# Altium project joint_board_boosterpack.PrjPCB
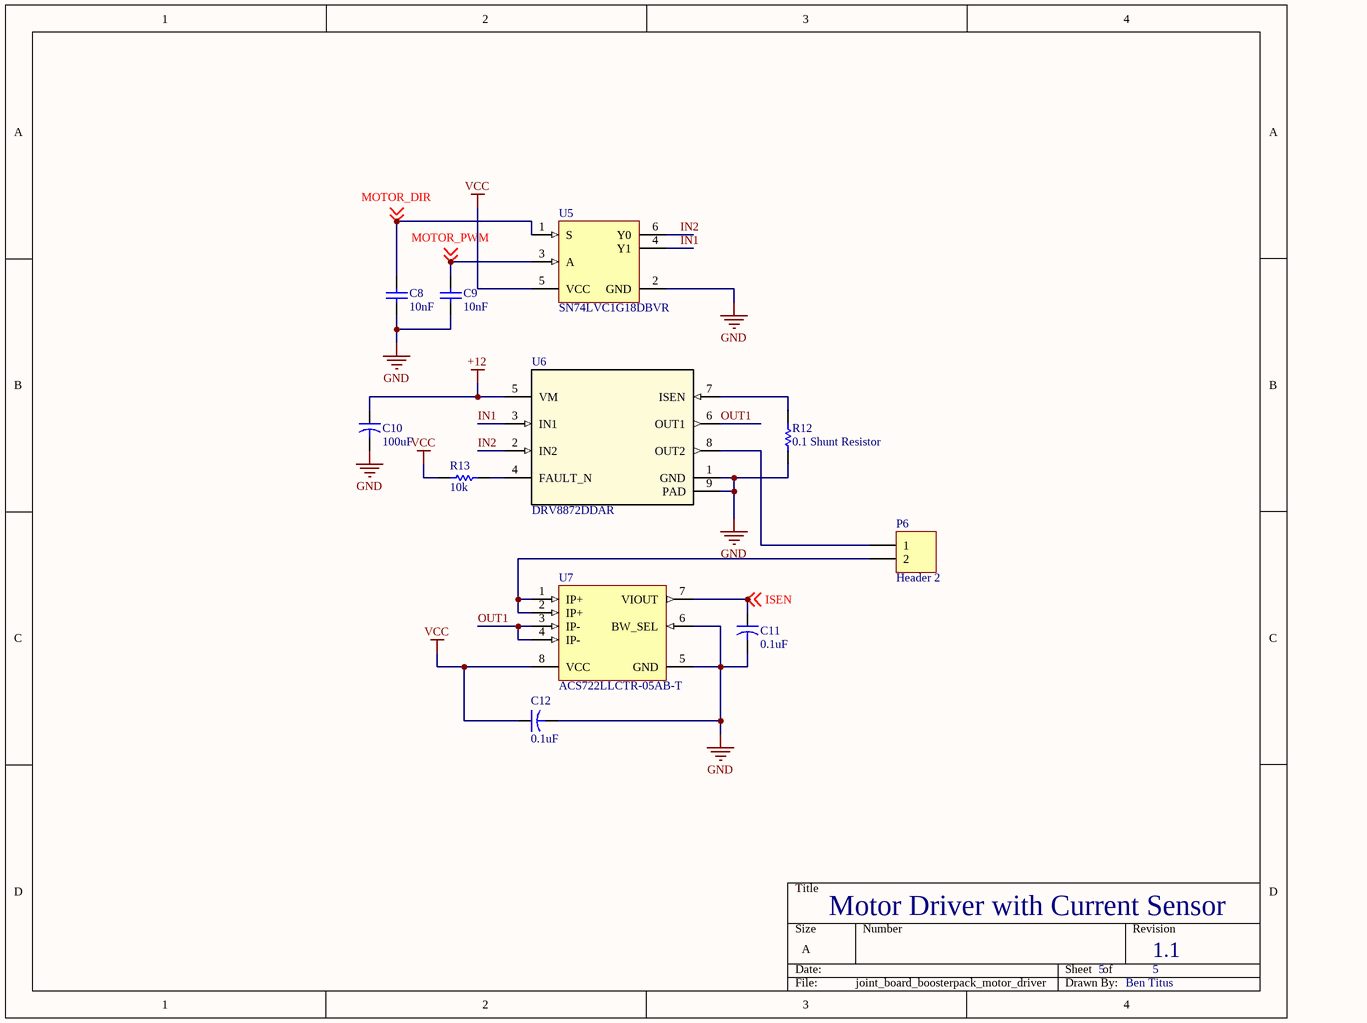
[diagram p0: joint_board_boosterpack_motor_drivers.SchDoc]
5 sheets, 43 parts. Net scope: global (net labels, ports and power ports of the same name join across sheets).
Board file: joint_board_boosterpack.PcbDoc
Sheets:
  joint_board_boosterpack_motor_drivers.SchDoc
  joint_board_boosterpack_load_cell.SchDoc
  joint_board_boosterpack_can.SchDoc
  joint_board_boosterpack_hall_effect_encoder.SchDoc
  joint_board_boosterpack.SchDoc

## Sheet joint_board_boosterpack_motor_drivers.SchDoc
size A; DocumentNumber: 5

### Parts
C8  10nF  [CAPC0805(2012)145_L]
C9  10nF  [CAPC0805(2012)145_L]
C10  100uF  [CAPR5-4X5]
C11  0.1uF  [CAPR5-4X5]
C12  0.1uF  [CAPR5-4X5]
P6  Header 2  [HDR1X2]
R12  0.1 Shunt Resistor  [RESC2512(6432)_L]
R13  10k  [RESC0805(2012)_L]
U5  SN74LVC1G18DBVR  [DBV0006A_L]
U6  DRV8872DDAR  [DDA0008H_N]
U7  ACS722LLCTR-05AB-T  [ALEG-LC-8_V]

### Nets
+12: C10.1 U6.5(VM)
GND: C8.1 C9.1 C10.2 C11.2 C12.2 R12.1 U5.2(GND) U6.1(GND) U6.9(PAD) U7.5(GND) U7.6(BW_SEL)
VCC: C12.1 R13.1 U5.5(VCC) U7.8(VCC)
IN1: U5.4(Y1) U6.3(IN1)
IN2: U5.6(Y0) U6.2(IN2)
ISEN: C11.1 U7.7(VIOUT) ; off-sheet ISEN
MOTOR_DIR: C8.2 U5.1(S) ; off-sheet MOTOR_DIR
MOTOR_PWM: C9.2 U5.3(A) ; off-sheet MOTOR_PWM
OUT1: U6.6(OUT1) U7.3(IP-) U7.4(IP-)
NetP6_1: P6.1 U6.8(OUT2)
NetP6_2: P6.2 U7.1(IP+) U7.2(IP+)
NetR12_2: R12.2 U6.7(ISEN)
NetR13_2: R13.2 U6.4(FAULT_N)

### Notes on the sheet
- Motor Driver with Current Sensor
- 5
- 1.1
- Ben Titus

### Library data of the parts
C8 C9 = CMP-1590-00003-1: 0805 (2012 Metric) Chip Capacitor; Case-EIA: 0805; Case-Metric: 2012; PackageReference: CAPC0805(2012)145
C10 = Cap2: 100uF Filter Capacitor; Published: 23-Sep-2002; PackageReference: CAPR5-4X5; Publisher: Altium Limited; PackageDescription: Capacitor; 2 Leads; Value: 100uF
C11 C12 = Cap2: Capacitor; Published: 23-Sep-2002; PackageReference: CAPR5-4X5; Publisher: Altium Limited; PackageDescription: Capacitor; 2 Leads; Value: 0.1uF
P6 = Header 2: Header, 2-Pin; LatestRevisionDate: 17-Jul-2002; LatestRevisionNote: Re-released for DXP Platform.; Publisher: Altium Limited
R12 = CMP-1591-00007-1: 2512 (6432 Metric) Chip Resistor; Case-EIA: 2512; Case-Metric: 6432; PackageReference: RESC2512(6432)
R13 = CMP-1591-00002-1: 0805 (2012 Metric) Chip Resistor; Case-EIA: 0805; Case-Metric: 2012; PackageReference: RESC0805(2012)
U5 = CMP-0859-00184-3: One of Two Noninverting Demultiplexer with 3-State Deselected Output, DBV0006A, LARGE T&R; Manufacturer: Texas Instruments; Technology Family: LVC; Specialty Logic Family: Decoder/Encoder/Multiplexer; 3-State Output: No; F @ Nom Voltage(Max)(Mhz): 150; VCC(Max)(V): 5.5; Rating: Catalog; Logic: True; Output Type: CMOS; Voltage(Nom)(V): 1.8,2.5,3.3,5; Output Drive (IOL/IOH)(Max)(mA): 32/-32; tpd @ Nom Voltage(Max)(ns): 9.3,5,4.2,3.2; Input Type: CMOS/TTL; Bits(#): 1; ICC @ Nom Voltage(Max)(mA): 0.01; VCC(Min)(V): 1.65; Generic Part Number: SN74LVC1G18; Operating Temperature Range(C): -40 to 85; Sub-Family: Decoder/Encoder/Multiplexer; PackageReference: DBV0006A; DatasheetVersion: SCES406K; Schmitt Trigger: No
U6 = DRV8872DDAR: Imported; Manufacturer: Texas Instruments; CompType: IC; PIN_COUNT: 9; PartNumber: DRV8872DDAR; Alternate_PartNumber: DRV8872DDA; PackageReference: DDA0008H; MountType: SMT; RefDes: RefDes; TYPE: TYPE; Value: Value
U7 = CMP-1557-00006-1: High Accuracy, Galvanically Isolated Current Sensor IC, 3 to 3.6 V, -5 to 5 A IP, -40 to 150 degC, 8-Pin SOIC (LC), RoHS, Tape and Reel; VCC Min: 3 V; IP Max: 5 A; IP Min: -5 A; VCC Max: 3.6 V; ComponentLink3URL: http://www.allegromicro.com/~/media/Files/Datasheets/ACS711-Datasheet.ashx?la=en; RoHS: TRUE; PartNumber: ACS722LLCTR-05AB-T; ComponentLink1Description: Manufacturer URL; ComponentLink1URL: http://www.allegromicro.com/; ComponentLink3Description: Package Specification; Temperature Min: -40 degC; Packing: Tape and Reel; PackageDescription: 8-Pin Small Outline Integrated Package, Body 4.9 x 3.9 mm, Pitch 1.27 mm; ComponentLink2URL: http://www.allegromicro.com/~/media/Files/Datasheets/ACS722-Datasheet.ashx?la=en; Mounting Technology: Surface Mount; Temperature Max: 150 degC; ComponentLink2Description: Datasheet

## Sheet joint_board_boosterpack_load_cell.SchDoc
size A; DocumentNumber: 4
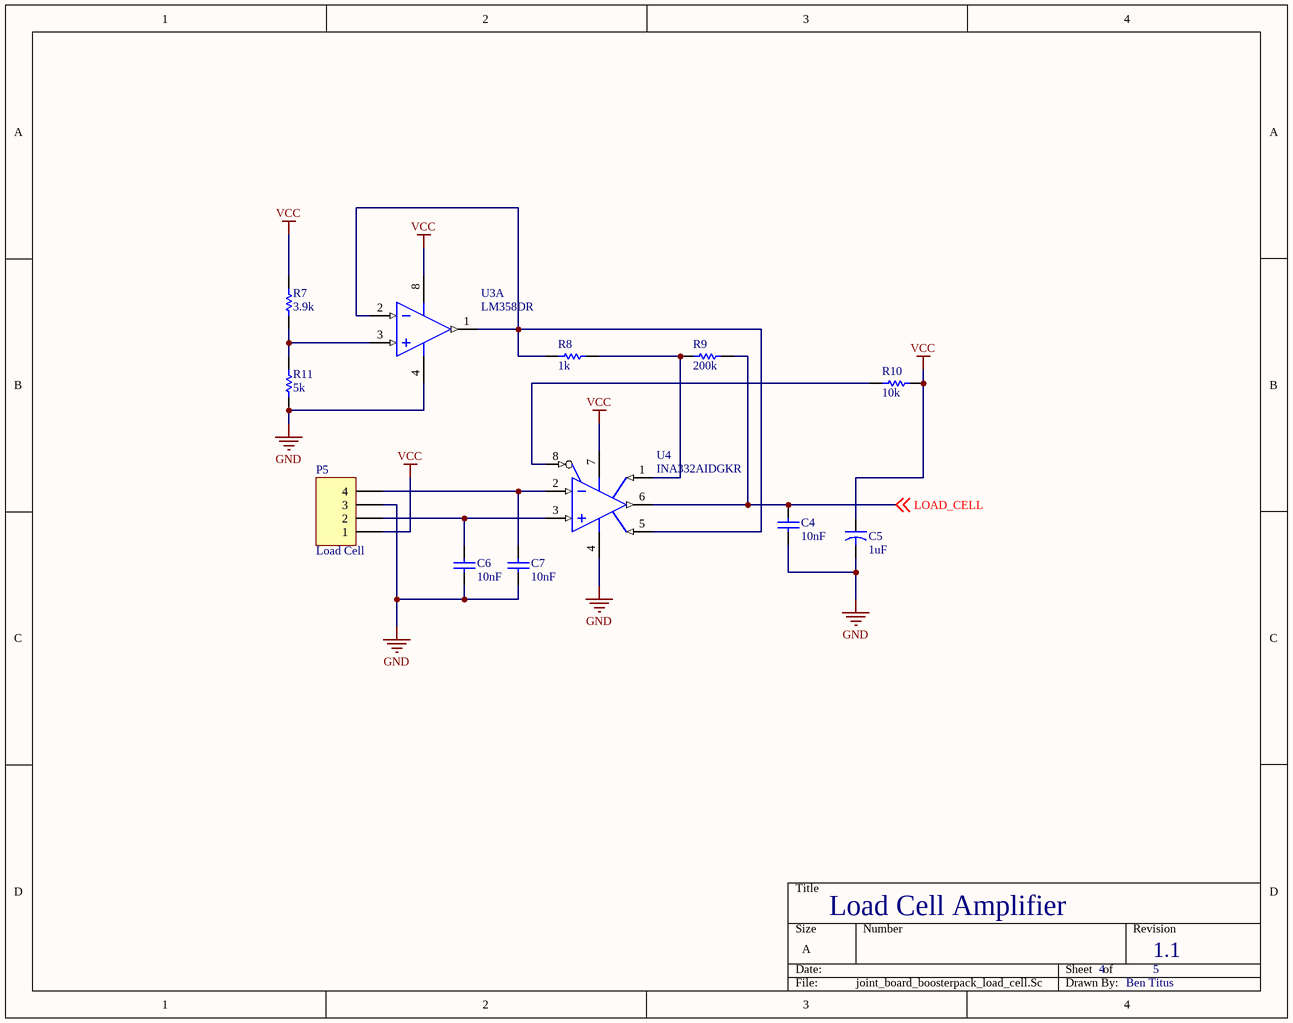
[diagram p1: joint_board_boosterpack_load_cell.SchDoc]

### Parts
C4  10nF  [CAPC0805(2012)145_L]
C5  1uF  [CAPR5-4X5]
C6  10nF  [CAPC0805(2012)145_L]
C7  10nF  [CAPC0805(2012)145_L]
P5  Load Cell  [HDR1X4]
R7  3.9k  [RESC0805(2012)_L]
R8  1k  [RESC0805(2012)_L]
R9  200k  [RESC0805(2012)_L]
R10  10k  [RESC0805(2012)_L]
R11  5k  [RESC0805(2012)_L]
U3  LM358DR  [D0008A_L]  (part A of 2)
U4  INA332AIDGKR  [DGK0008A_M]

### Nets
GND: C4.1 C5.2 C6.1 C7.1 P5.3 R11.1 U3.4(GND) U4.4(V-)
VCC: C5.1 P5.1 R7.2 R10.1 U3.8(VCC) U4.7(V+)
LOAD_CELL: C4.2 R9.2 U4.6(VOUT) ; off-sheet LOAD_CELL
NetC6_2: C6.2 P5.2 U4.3(VIN+)
NetC7_2: C7.2 P5.4 U4.2(VIN-)
NetR7_1: R7.1 R11.2 U3.3(1IN+)
NetR8_1: R8.1 U3.1(1OUT) U3.2(1IN-) U4.5(REF)
NetR8_2: R8.2 R9.1 U4.1(RG)
NetR10_2: R10.2 U4.8(SHUTDOWN)

### Notes on the sheet
- Load Cell Amplifier
- 4
- 1.1
- 5
- Ben Titus

### Library data of the parts
C4 C6 C7 = CMP-1590-00003-1: as C8 on sheet joint_board_boosterpack_motor_drivers; PackageReference: CAPC0805(2012)145
C5 = Cap2: Capacitor; Published: 23-Sep-2002; PackageReference: CAPR5-4X5; Publisher: Altium Limited; PackageDescription: Capacitor; 2 Leads; Value: 1uF
P5 = Header 4: Header, 4-Pin; LatestRevisionDate: 17-Jul-2002; LatestRevisionNote: Re-released for DXP Platform.; Publisher: Altium Limited
R7-R11 = CMP-1591-00002-1: as R13 on sheet joint_board_boosterpack_motor_drivers; PackageReference: RESC0805(2012)
U3 = CMP-1685-00009-1: Dual Operational Amplifier, 3 to 32 V, 0 to 70 degC, 8-Pin SOIC (D), Green (RoHS & no Sb/Br), Tape and Reel; DatasheetVersion: SLOS068T, 04/2015; ComponentLink1URL: http://www.ti.com/; ComponentLink2URL: http://www.ti.com/lit/ds/symlink/lm358.pdf; ComponentLink3Description: Package Specification; Code_JEDEC: MS-012; PackageDescription: 8-Pin Small Outline Integrated Circuit, Body 4.9 x 3.9 mm, Pitch 1.27 mm; ComponentLink2Description: Datasheet; PackageVersion: 4040047-3/M, 06/2011; ComponentLink1Description: Manufacturer URL; ComponentLink3URL: http://www.ti.com/lit/ml/msoi002j/msoi002j.pdf; PackageReference: D0008A
U4 = CMP-0944-00077-2: Low-Power, Single Supply, CMOS, Low Cost, Instrumentation Amplifier, -55 to 125 degC, 8-pin SOP (DGK8), Green (RoHS & no Sb/Br); Manufacturer: Texas Instruments; Noise at 1kHz(Typ)(nV/rt(Hz)): 46; Quiescent Current (+/-)(Typ)(mA): 0.415; Gain(V/V): 5 to 1000; Vs(Min)(V): 2.5; Number of Channels: 1; Vs(Max)(V): 5.5; CMRR(Min)(dB): 60; Input Bias Current (+/-)(Max)(nA): 0.01; Input Offset (+/-)(Max)(uV): 8000; DatasheetVersion: SBOS216B; ComponentLink3URL: http://www.ti.com/litv/pdf/mpds028d; PartNumber: INA332AIDGKR; ComponentLink2Description: Datasheet; ComponentLink1URL: http://www.ti.com/; ComponentLink1Description: Manufacturer URL; Code_JEDEC: MO-187; SubFamily: Single Supply; ComponentLink3Description: Package Specification; Mounting Technology: Surface Mount; PackageReference: DGK0008A; PackageDescription: 8-Pin Thin Small Outline, Body 3 x 3 mm, Pitch 0.65 mm; PackageVersion: 4073329/E, 05/2006; Eco-Plan: Green (RoHS & no Sb/Br); Non-Linearity (+/-)(Max)(%): 0.01; ComponentLink2URL: http://www.ti.com/general/docs/lit/getliterature.tsp?genericPartNumber=INA332&fileType=pdf

## Sheet joint_board_boosterpack_can.SchDoc
size A; DocumentNumber: 2
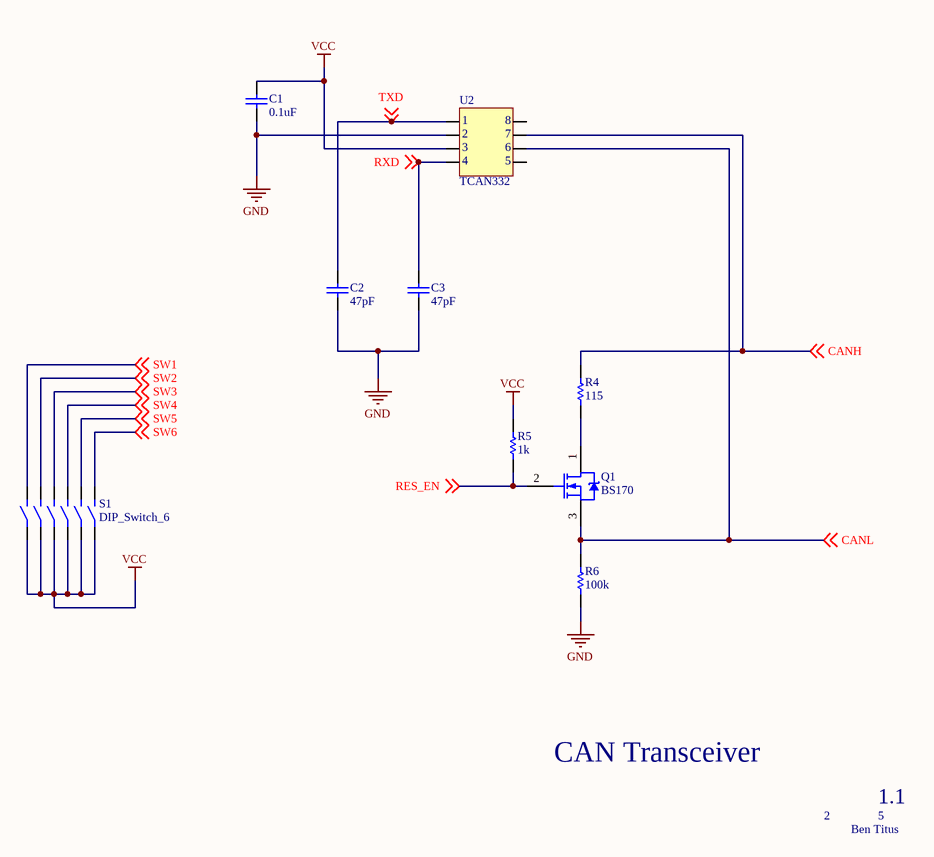
[diagram p2: joint_board_boosterpack_can.SchDoc]

### Parts
C1  0.1uF  [CAPC0805(2012)145_L]
C2  47pF  [CAPC0805(2012)145_L]
C3  47pF  [CAPC0805(2012)145_L]
Q1  BS170  [SOT23-3]
R4  115  [RESC0805(2012)_L]
R5  1k  [RESC0805(2012)_L]
R6  100k  [RESC0805(2012)_L]
S1  DIP_Switch_6  [SOP12]
U2  TCAN332  [SOP8]

### Nets
GND: C1.1 C2.1 C3.1 R6.1 U2.2
VCC: C1.2 R5.2 S1.1 S1.2 S1.3 S1.4 S1.5 S1.6 U2.3
CANH: R4.2 U2.7 ; off-sheet CANH
CANL: Q1.3(S) R6.2 U2.6 ; off-sheet CANL
RES_EN: Q1.2(G) R5.1 ; off-sheet RES_EN
RXD: C3.2 U2.4 ; off-sheet RXD
SW1: S1.12 ; off-sheet SW1
SW2: S1.11 ; off-sheet SW2
SW3: S1.10 ; off-sheet SW3
SW4: S1.9 ; off-sheet SW4
SW5: S1.8 ; off-sheet SW5
SW6: S1.7 ; off-sheet SW6
TXD: C2.2 U2.1 ; off-sheet TXD
NetQ1_1: Q1.1(D) R4.1

Not connected (* = marked no-connect by the designer): U2 5 8

### Notes on the sheet
- CAN Transceiver
- 2
- 1.1
- 5
- Ben Titus

### Library data of the parts
C1-C3 = CMP-1590-00003-1: as C8 on sheet joint_board_boosterpack_motor_drivers; PackageReference: CAPC0805(2012)145
Q1 = BS170: Small Signal MOSFET, 500 mA, 60 V, N-Channel, 3-Pin TO-92, Bulk Box; pin to pad: 1>3 2>1 3>2; Manufacturer: On Semiconductor; Channel Polarity: N Channel; Configuration: Single; ID Max (A): 0.5; PD Max (W): 0.35; V(BR)DSS Min (V): 60; VGS Max (V): 20; VGS(th) Max (V): 3; DatasheetVersion: Rev. 6; PackageVersion: Rev. AM; PackageReference: TO-92-3-29-11_AM_SL; PackageDescription: 3-Pin Transistor Outline, Body 4.825 x 3.685 mm, Pitch 1.27 mm; Supplier 1: Digi-Key; Supplier Part Number 1: BS170OS-ND; Package Type: TO-92; Packing: Bulk Box; Mounting Technology: Through Hole; PartNumber: BS170; ComponentLink1Description: Manufacturer URL; ComponentLink1URL: http://www.onsemi.com/; ComponentLink2Description: Datasheet; ComponentLink2URL: http://www.onsemi.com/pub_link/Collateral/BS170-D.PDF; ComponentLink3Description: Package Specification; ComponentLink3URL: http://www.onsemi.cn/pub_link/Collateral/2N6426-D.PDF
R4-R6 = CMP-1591-00002-1: as R13 on sheet joint_board_boosterpack_motor_drivers; PackageReference: RESC0805(2012)
S1 = DIP_Switch_6: 6 pin DIP switch
U2 = TCAN332: 3.3V CAN Transceiver

## Sheet joint_board_boosterpack_hall_effect_encoder.SchDoc
size A; DocumentNumber: 3
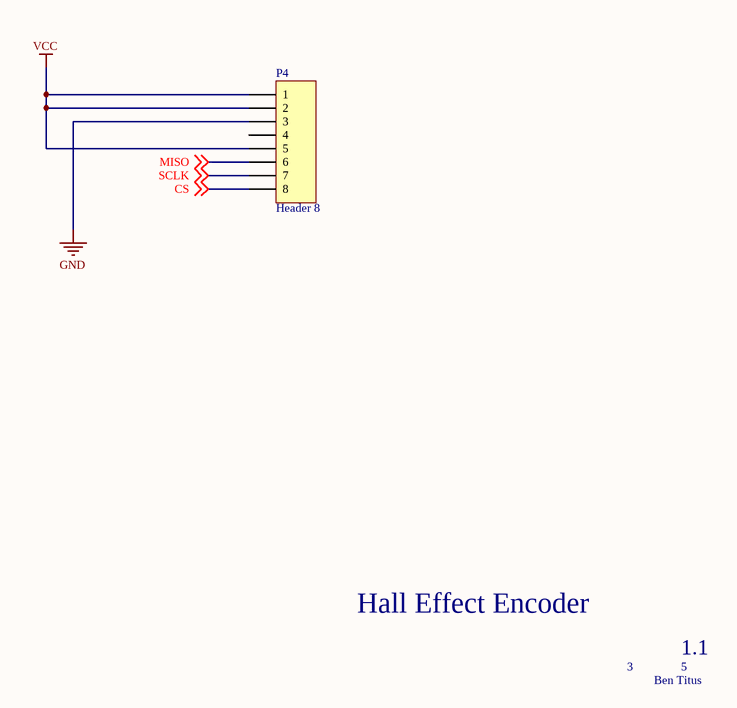
[diagram p3: joint_board_boosterpack_hall_effect_encoder.SchDoc]

### Parts
P4  Header 8  [HDR1X8]

### Nets
GND: P4.3
VCC: P4.1 P4.2 P4.5
CS: P4.8 ; off-sheet CS
MISO: P4.6 ; off-sheet MISO
SCLK: P4.7 ; off-sheet SCLK

Not connected (* = marked no-connect by the designer): P4 4

### Notes on the sheet
- Hall Effect Encoder
- 3
- 1.1
- 5
- Ben Titus

### Library data of the parts
P4 = Header 8: Header, 8-Pin; LatestRevisionDate: 17-Jul-2002; LatestRevisionNote: Re-released for DXP Platform.; Publisher: Altium Limited

## Sheet joint_board_boosterpack.SchDoc
size A; Engineer: Ben Titus; DocumentNumber: 1; Revision: 1.0; SheetNumber: 1
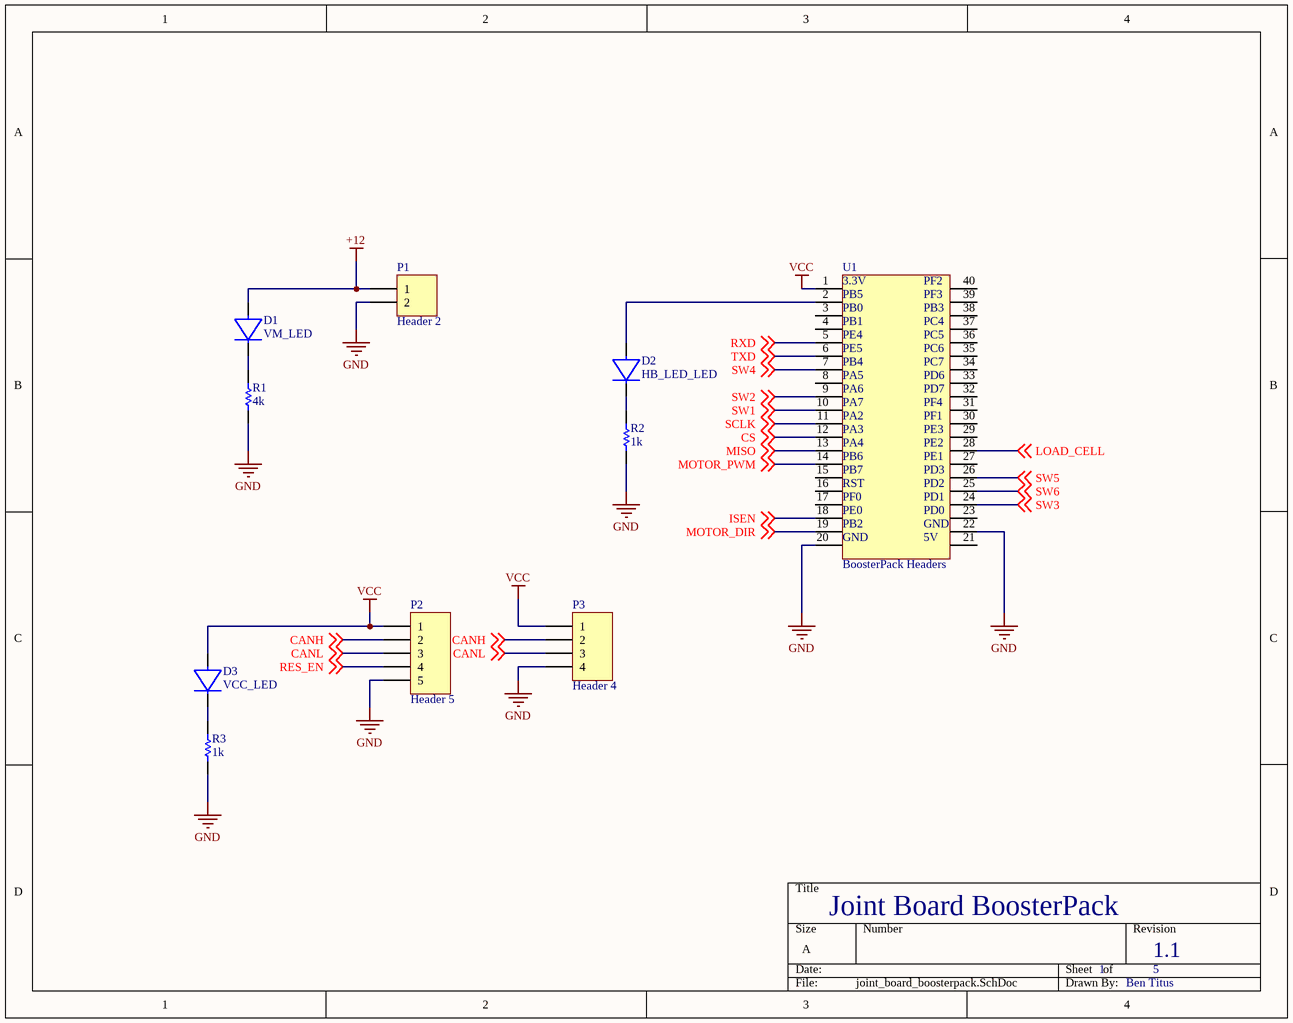
[diagram p4: joint_board_boosterpack.SchDoc]

### Parts
D1  VM_LED  [0805 Diode]
D2  HB_LED_LED  [0805 Diode]
D3  VCC_LED  [0805 Diode]
P1  Header 2  [HDR1X2]
P2  Header 5  [HDR1X5]
P3  Header 4  [HDR1X4]
R1  4k  [RESC0805(2012)_L]
R2  1k  [RESC0805(2012)_L]
R3  1k  [RESC0805(2012)_L]
U1  BoosterPack Headers  [boosterpack_headers]

### Nets
+12: D1.1 P1.1
GND: P1.2 P2.5 P3.4 R1.1 R2.1 R3.1 U1.20 U1.22
VCC: D3.1 P2.1 P3.1 U1.1
CANH: P2.2 P3.2 ; off-sheet CANH
CANL: P2.3 P3.3 ; off-sheet CANL
CS: U1.12 ; off-sheet CS
ISEN: U1.18 ; off-sheet ISEN
LOAD_CELL: U1.28 ; off-sheet LOAD_CELL
MISO: U1.13 ; off-sheet MISO
MOTOR_DIR: U1.19 ; off-sheet MOTOR_DIR
MOTOR_PWM: U1.14 ; off-sheet MOTOR_PWM
RES_EN: P2.4 ; off-sheet RES_EN
RXD: U1.5 ; off-sheet RXD
SCLK: U1.11 ; off-sheet SCLK
SW1: U1.10 ; off-sheet SW1
SW2: U1.9 ; off-sheet SW2
SW3: U1.24 ; off-sheet SW3
SW4: U1.7 ; off-sheet SW4
SW5: U1.26 ; off-sheet SW5
SW6: U1.25 ; off-sheet SW6
TXD: U1.6 ; off-sheet TXD
NetD1_2: D1.2 R1.2
NetD2_1: D2.1 U1.2
NetD2_2: D2.2 R2.2
NetD3_2: D3.2 R3.2

Not connected (* = marked no-connect by the designer): U1 3 4 8 15 16 17 21 23 27 29 30 31 32 33 34 35 36 37 38 39 40

### Notes on the sheet
- Joint Board BoosterPack
- 1
- 1.1
- 5
- Ben Titus
- (in symbol BoosterPack Headers) 3.3V; PF2; PB5; PF3; PB0; PB3; PB1; PC4; PE4; PC5; PE5; PC6; PB4; PC7; PA5; PD6; PA6; PD7; PA7; PF4; PA2; PF1; PA3; PE3; PA4; PE2; PB6; PE1; PB7; PD3; RST; PD2; PF0; PD1; PE0; PD0; PB2; GND; 5V

### Library data of the parts
D1-D3 = SMD_LED
P1 = Header 2: Header, 2-Pin; LatestRevisionDate: 17-Jul-2002; LatestRevisionNote: Re-released for DXP Platform.; Publisher: Altium Limited
P2 = Header 5: Header, 5-Pin; LatestRevisionDate: 17-Jul-2002; LatestRevisionNote: Re-released for DXP Platform.; Publisher: Altium Limited
P3 = Header 4: Header, 4-Pin; LatestRevisionDate: 17-Jul-2002; LatestRevisionNote: Re-released for DXP Platform.; Publisher: Altium Limited
R1-R3 = CMP-1591-00002-1: as R13 on sheet joint_board_boosterpack_motor_drivers; PackageReference: RESC0805(2012)

## Nets that join several sheets
+12: joint_board_boosterpack_motor_drivers (C10.1 U6.5), joint_board_boosterpack (D1.1 P1.1)
GND: joint_board_boosterpack_motor_drivers (11 pins), joint_board_boosterpack_load_cell (8 pins), joint_board_boosterpack_can (5 pins), joint_board_boosterpack_hall_effect_encoder (P4.3), joint_board_boosterpack (8 pins)
VCC: joint_board_boosterpack_motor_drivers (C12.1 R13.1 U5.5 U7.8), joint_board_boosterpack_load_cell (6 pins), joint_board_boosterpack_can (9 pins), joint_board_boosterpack_hall_effect_encoder (P4.1 P4.2 P4.5), joint_board_boosterpack (D3.1 P2.1 P3.1 U1.1)
CANH: joint_board_boosterpack_can (R4.2 U2.7), joint_board_boosterpack (P2.2 P3.2)
CANL: joint_board_boosterpack_can (Q1.3 R6.2 U2.6), joint_board_boosterpack (P2.3 P3.3)
CS: joint_board_boosterpack_hall_effect_encoder (P4.8), joint_board_boosterpack (U1.12)
ISEN: joint_board_boosterpack_motor_drivers (C11.1 U7.7), joint_board_boosterpack (U1.18)
LOAD_CELL: joint_board_boosterpack_load_cell (C4.2 R9.2 U4.6), joint_board_boosterpack (U1.28)
MISO: joint_board_boosterpack_hall_effect_encoder (P4.6), joint_board_boosterpack (U1.13)
MOTOR_DIR: joint_board_boosterpack_motor_drivers (C8.2 U5.1), joint_board_boosterpack (U1.19)
MOTOR_PWM: joint_board_boosterpack_motor_drivers (C9.2 U5.3), joint_board_boosterpack (U1.14)
RES_EN: joint_board_boosterpack_can (Q1.2 R5.1), joint_board_boosterpack (P2.4)
RXD: joint_board_boosterpack_can (C3.2 U2.4), joint_board_boosterpack (U1.5)
SCLK: joint_board_boosterpack_hall_effect_encoder (P4.7), joint_board_boosterpack (U1.11)
SW1: joint_board_boosterpack_can (S1.12), joint_board_boosterpack (U1.10)
SW2: joint_board_boosterpack_can (S1.11), joint_board_boosterpack (U1.9)
SW3: joint_board_boosterpack_can (S1.10), joint_board_boosterpack (U1.24)
SW4: joint_board_boosterpack_can (S1.9), joint_board_boosterpack (U1.7)
SW5: joint_board_boosterpack_can (S1.8), joint_board_boosterpack (U1.26)
SW6: joint_board_boosterpack_can (S1.7), joint_board_boosterpack (U1.25)
TXD: joint_board_boosterpack_can (C2.2 U2.1), joint_board_boosterpack (U1.6)